# EAGLE schematic port-expander (EAGLE 6.4)
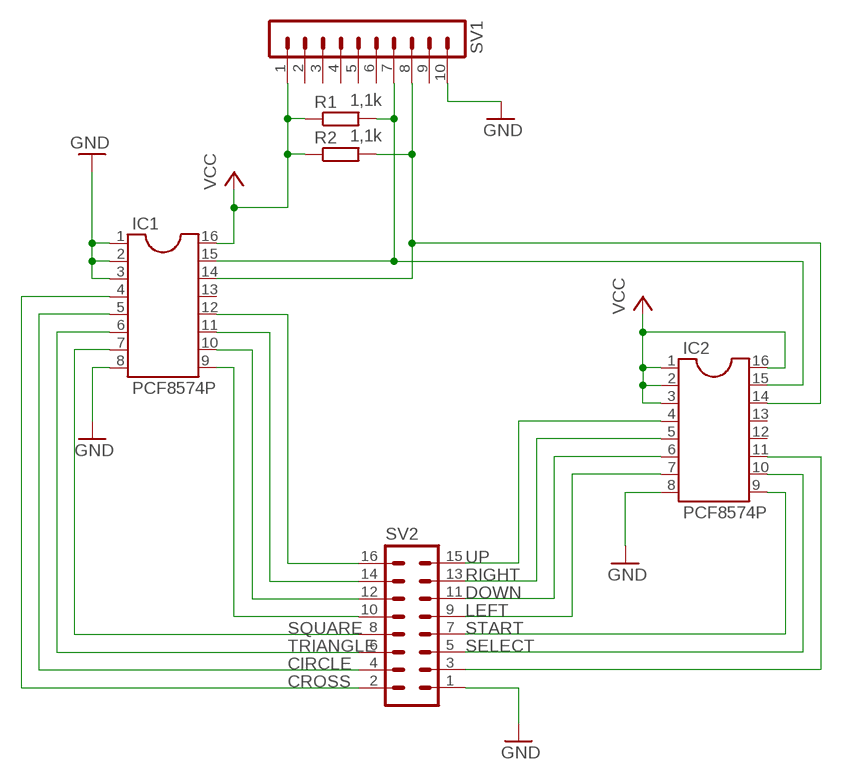
[diagram p0: schematic, sheet 1]

## Parts
IC1  PCF8574P  DIL16S  [SOCKET-16]
IC2  PCF8574P  DIL16S  [SOCKET-16]
R1  1,1k  R-EU_0207/10  [0207/10]
R2  1,1k  R-EU_0207/10  [0207/10]
SV1  MA10-1  [MA10-1]
SV2  MA08-2  [MA08-2]

## Nets
CIRCLE: IC1.5 SV2.4
CROSS: IC1.4 SV2.2
DOWN: IC2.6 SV2.11
GND: IC1.1 IC1.2 IC1.3 IC1.8 IC2.8 SV1.10 SV2.1
LEFT: IC2.7 SV2.9
N$7: IC1.12 SV2.16
N$8: IC1.11 SV2.14
N$9: IC1.10 SV2.12
N$10: IC1.9 SV2.10
N$15: IC2.11 SV2.3
N$17: IC1.14 IC2.14 R2.2 SV1.8
N$18: IC1.15 IC2.15 R1.2 SV1.7
RIGHT: IC2.5 SV2.13
SELECT: IC2.10 SV2.5
SQUARE: IC1.7 SV2.8
START: IC2.9 SV2.7
TRIANGLE: IC1.6 SV2.6
UP: IC2.4 SV2.15
VCC: IC1.16 IC2.1 IC2.2 IC2.3 IC2.16 R1.1 R2.1 SV1.1
Unconnected: IC1.13 IC2.12 IC2.13 SV1.2 SV1.3 SV1.4 SV1.5 SV1.6 SV1.9

## Library data of the parts
IC1 IC2 = ic-package:DIL16: Dual In Line / Socket
R1 R2 = resistor:R-EU_: RESISTOR, European symbol
SV1 = con-lstb:MA10-1: PIN HEADER; OC_FARNELL: unknown; OC_NEWARK: unknown
SV2 = con-lstb:MA08-2: PIN HEADER; OC_FARNELL: unknown; OC_NEWARK: unknown